# Altium project Cerberus_Board_v3.PrjPcb (part 2 of 3)

## Sheet spirit1_433.SchDoc: Spirit1_433
size A4; Author: r.rodriguezz; Organization: B105 Laboratory; Address1: Integrated Systems Laboratory; Address2: ETSIT - UPM; Address3: Avda Complutense, 30; Address4: 28040 Madrid Spain
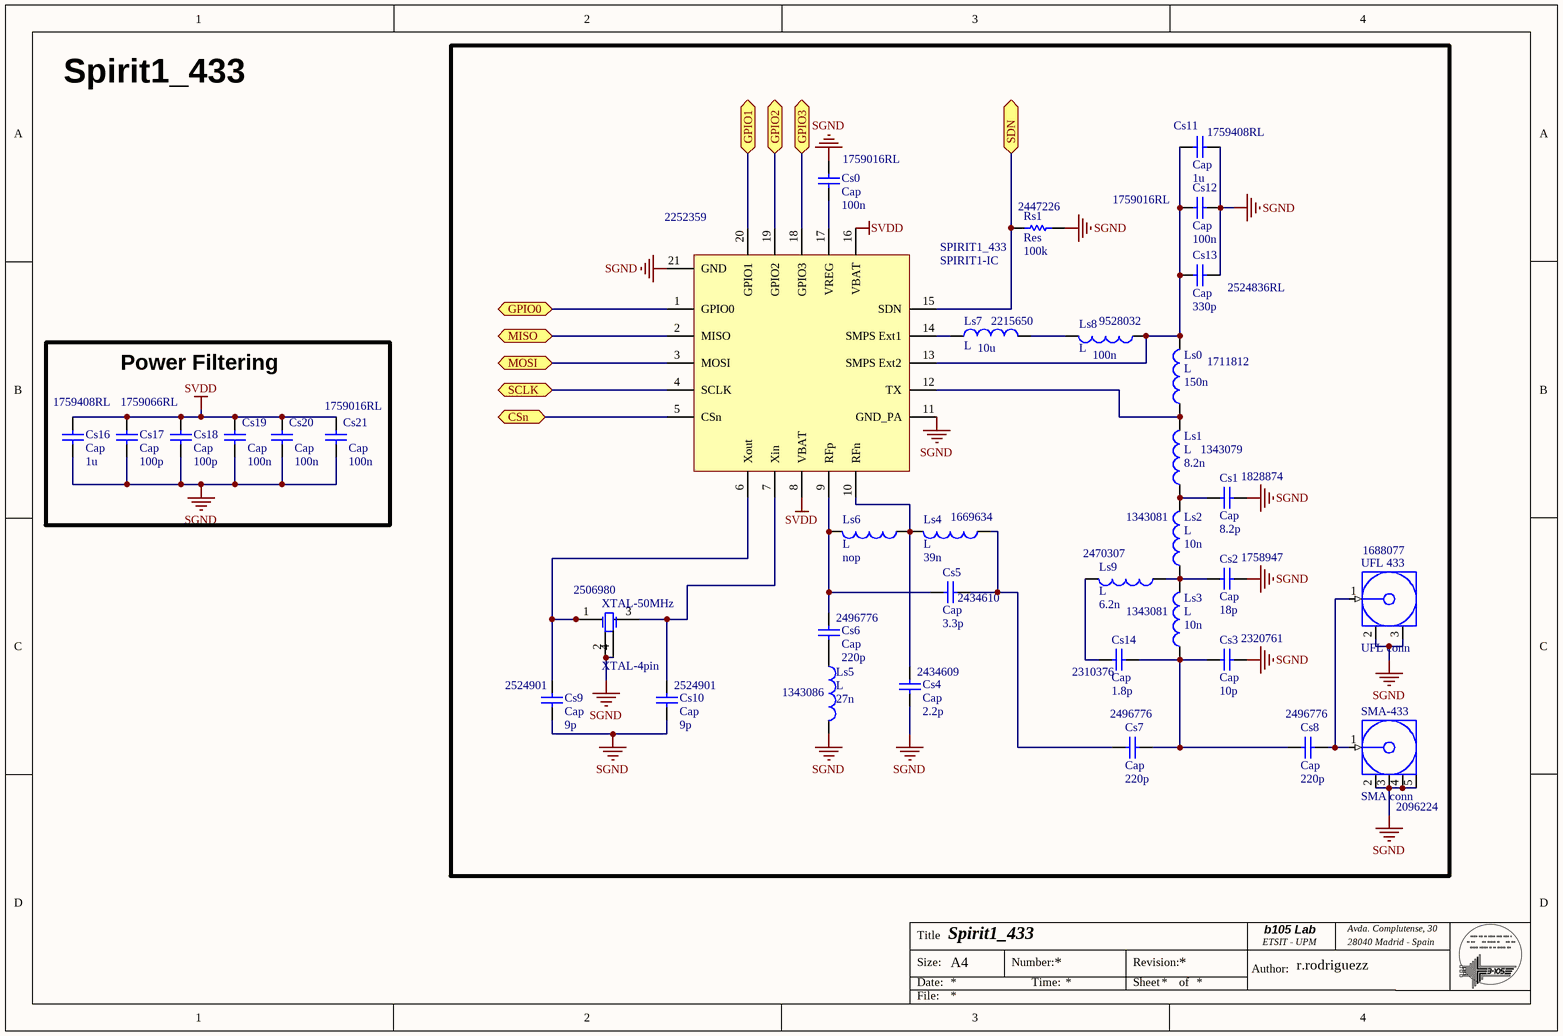
[diagram p2: spirit1_433.SchDoc]

### Parts
Cs0  Cap  value 100n  Supplier Part Number 1: 1759016RL  [0603 Cap]
Cs1  Cap  value 8.2p  Supplier Part Number 1: 1828874  [0402 CAP]
Cs2  Cap  value 18p  Supplier Part Number 1: 1758947  [0402 CAP]
Cs3  Cap  value 10p  Supplier Part Number 1: 2320761  [0402 CAP]
Cs4  Cap  value 2.2p  Supplier Part Number 1: 2434609  [0402 CAP]
Cs5  Cap  value 3.3p  Supplier Part Number 1: 2434610  [0402 CAP]
Cs6  Cap  value 220p  Supplier Part Number 1: 2496776  [0402 CAP]
Cs7  Cap  value 220p  Supplier Part Number 1: 2496776  [0402 CAP]
Cs8  Cap  value 220p  Supplier Part Number 1: 2496776  [0402 CAP]
Cs9  Cap  value 9p  Supplier Part Number 1: 2524901  [0603 Cap]
Cs10  Cap  value 9p  Supplier Part Number 1: 2524901  [0603 Cap]
Cs11  Cap  value 1u  Supplier Part Number 1: 1759408RL  [0603 Cap]
Cs12  Cap  value 100n  Supplier Part Number 1: 1759016RL  [0603 Cap]
Cs13  Cap  value 330p  Supplier Part Number 1: 2524836RL  [0603 Cap]
Cs14  Cap  value 1.8p  Supplier Part Number 1: 2310376  [0402 CAP]
Cs16  Cap  value 1u  Supplier Part Number 1: 1759408RL  [0603 Cap]
Cs17  Cap  value 100p  Supplier Part Number 1: 1759066RL  [0603 Cap]
Cs18  Cap  value 100p  [0603 Cap]
Cs19  Cap  value 100n  [0603 Cap]
Cs20  Cap  value 100n  [0603 Cap]
Cs21  Cap  value 100n  Supplier Part Number 1: 1759016RL  [0603 Cap]
Ls0  L  value 150n  Supplier Part Number 1: 1711812  [0603 IND]
Ls1  L  value 8.2n  Supplier Part Number 1: 1343079  [0402 IND]
Ls2  L  value 10n  Supplier Part Number 1: 1343081  [0402 IND]
Ls3  L  value 10n  Supplier Part Number 1: 1343081  [0402 IND]
Ls4  L  value 39n  Supplier Part Number 1: 1669634  [0402 IND]
Ls5  L  value 27n  Supplier Part Number 1: 1343086  [0402 IND]
Ls6  L  value nop  [0402 IND]
Ls7  L  value 10u  Supplier Part Number 1: 2215650  [0805 Ind]
Ls8  L  value 100n  Supplier Part Number 1: 9528032  [0603 IND]
Ls9  L  value 6.2n  Supplier Part Number 1: 2470307  [0402 IND]
Rs1  Res  value 100k  Supplier Part Number 1: 2447226  [0603 Res]
SMA-433  SMA conn  Supplier Part Number 1: 2096224  [SMA-conn]
SPIRIT1_433  SPIRIT1-IC  Supplier Part Number 1: 2252359  [QFN-20]
UFL_433  UFL conn  Supplier Part Number 1: 1688077  [UFL conn]
XTAL-50MHz  XTAL-4pin  Supplier Part Number 1: 2506980  [XTAL-4PIN-2mmx1.6mm]

### Blocks framed on the sheet
Power Filtering: Cs16-Cs21

### Ports
CSn (bidir), GPIO0 (bidir), GPIO1 (bidir), GPIO2 (bidir), GPIO3 (bidir), MISO (bidir), MOSI (bidir), SCLK (bidir), SDN (bidir)

### Nets
SGND: Cs0.2 Cs1.1 Cs2.1 Cs3.1 Cs4.1 Cs9.1 Cs10.1 Cs11.1 Cs12.1 Cs13.1 Cs16.1 Cs17.1 Cs18.1 Cs19.1 Cs20.1 Cs21.1 Ls5.2 Rs1.2 SMA-433.2(GND) SMA-433.3(GND) SMA-433.4(GND) SMA-433.5(GND) SPIRIT1_433.11(GND_PA) SPIRIT1_433.21(GND) UFL_433.2(GND) UFL_433.3(GND) XTAL-50MHz.2(GND) XTAL-50MHz.4(GND)
SVDD: Cs16.2 Cs17.2 Cs18.2 Cs19.2 Cs20.2 Cs21.2 SPIRIT1_433.8(VBAT) SPIRIT1_433.16(VBAT)
CS_S: SPIRIT1_433.5(CSn) ; port CSn
MISO: SPIRIT1_433.2(MISO) ; port MISO
MOSI: SPIRIT1_433.3(MOSI) ; port MOSI
S_GPIO3: SPIRIT1_433.18(GPIO3) ; port GPIO3
SCK: SPIRIT1_433.4(SCLK) ; port SCLK
SDN_S: Rs1.1 SPIRIT1_433.15(SDN) ; port SDN
NetCs0_1: Cs0.1 SPIRIT1_433.17(VREG)
NetCs1_2: Cs1.2 Ls1.1 Ls2.2
NetCs2_2: Cs2.2 Ls2.1 Ls3.2 Ls9.1
NetCs3_2: Cs3.2 Cs7.2 Cs8.1 Cs14.1 Ls3.1
NetCs4_2: Cs4.2 Ls4.2 Ls6.1 SPIRIT1_433.10(RFn)
NetCs5_1: Cs5.1 Cs7.1 Ls4.1
NetCs5_2: Cs5.2 Cs6.1 Ls6.2 SPIRIT1_433.9(RFp)
NetCs6_2: Cs6.2 Ls5.1
NetCs8_2: Cs8.2 SMA-433.1(Signal) UFL_433.1(Signal)
NetCs9_2: Cs9.2 SPIRIT1_433.6(Xout) XTAL-50MHz.1(OSC1)
NetCs10_2: Cs10.2 SPIRIT1_433.7(Xin) XTAL-50MHz.3(OSC2)
NetCs11_2: Cs11.2 Cs12.2 Cs13.2 Ls0.2 Ls8.1 SPIRIT1_433.13(SMPS_Ext2)
NetCs14_2: Cs14.2 Ls9.2
NetLs0_1: Ls0.1 Ls1.2 SPIRIT1_433.12(TX)
NetLs7_1: Ls7.1 SPIRIT1_433.14(SMPS_Ext1)
NetLs7_2: Ls7.2 Ls8.2
NetR10_2: SPIRIT1_433.1(GPIO0) ; port GPIO0
NetR11_2: SPIRIT1_433.20(GPIO1) ; port GPIO1
NetR12_2: SPIRIT1_433.19(GPIO2) ; port GPIO2

### Notes on the sheet
- Title
- Size:
- Date:
- A4
- Number:
- Time:
- Revision:
- Sheet
- of
- Author:
- ETSIT - UPM
- b105 Lab
- Avda. Complutense, 30
- 28040 Madrid - Spain
- File:

### Library data of the parts
Cs0 Cs12 Cs19-Cs21 = Cap: Manufacturer: MULTICOMP; Manufacturer Part Number: MC0603B104K160CT; Ceramic Capacitor Case: 0603 [1608 Metric]; Capacitance: 0.1; Voltage Rating: 16; Capacitance Tolerance: ± 10%; Dielectric Characteristic: X7; Product Range: MC Series; SVHC: No SVHC (17-Dec-2015)<!--FANDB--><div class="features-and-benefits-container"><div class="features-and-benefits-description"><span class="features-benefits-value">The Multicomp MC series is general purpose MLCC capacitors with X7R dielectric material which provides high electrical precision, stability and reliability. This MLCC capacitor consists of a conducting material and electrodes with high density and high efficiency ceramic condensers.</span></div><div class="features-and-benefits-list"><ul class="features-and-benefits-list-list"><li class="features-and-benefits-list-item">Small size with higher capacitance values</li><li class="features-and-benefits-list-item">0201, 0402, 0603, 0805, 1206, 1210, 1812 case sizes available</li><li class="features-and-benefits-list-item">Capacitance value ranging from 100pF to 47?F</li><li class="features-and-benefits-list-item">Capacitor with lead free termination (pure Tin)</li><li class="features-and-benefits-list-item">High electrical precision, stability and reliability</li><li class="features-and-benefits-list-item">Rated voltage of 6.3V, 10V, 16V, 25V, 50V, 100V</li><li class="features-and-benefits-list-item">Operating temperature of -55°C to +125°C</li><li class="features-and-benefits-list-item">Available in ±5%, ±10% and ±20; Description 1: MULTICOMP - MC0603B104K160CT - CAP, MLCC, X7R, 100NF, 16V, 0603; Supplier 1: Farnell; RoHS: YES; Stock 1: 78340; Pricing 1: 10=0.0065, 250=0.0053, 500=0.0044, 1000=0.0038, 2000=0.0033 (GBP); Packaging: Cut Tape; Operating Temperature Min: -55; Operating Temperature Max: 125; Automotive Qualification Standard: -; MSL: -; ComponentLink1URL: http://www.farnell.com/datasheets/1901289.pdf; ComponentLink1Description: http://www.farnell.com/datasheets/1901289.pdf
  Cs19 Cs20: Supplier Part Number 1: 1759016RL
Cs1 = Cap: Manufacturer: MURATA; Manufacturer Part Number: GRM1555C1H8R2CA01D; Description 1: MURATA - GRM1555C1H8R2CA01D - CAP, MLCC, C0G/NP0, 8.2PF, 50V, 0402; Ceramic Capacitor Case: 0402 [1005 Metric]; Capacitance: 8.2; Voltage Rating: 50; Capacitance Tolerance: ± 0.25; Dielectric Characteristic: C0G / NP0; Product Range: GRM Series; SVHC: No SVHC (17-Dec-2015); Capacitor Terminals: SMD<!--FANDB--><div class="features-and-benefits-container"><div class="features-and-benefits-description"><span class="features-benefits-value">The Murata GRM series capacitors are Multilayer Ceramic Chip Capacitors (MLCC) used for general purpose applications. These MLCC capacitors are classified into temperature compensating and high dielectric constant types depending on the change in electrostatic capacitance due to change in temperature. The temperature compensating capacitors feature a small rate of change in electrostatic capacitance as the temperature changes and are used for applications such as filters and high frequency circuit matching. The high dielectric constant capacitors use materials with a high dielectric constant and feature a large electrostatic capacitance. Typical applications are power supply decoupling and smoothing circuits.</span></div><div class="features-and-benefits-list"><ul class="features-and-benefits-list-list"><li class="features-and-benefits-list-item">Large capacity and small size in a multilayer structure</li><li class="features-and-benefits-list-item">Capacitance value ranging from 0.1pF to 220?F</li><li class="features-and-benefits-list-item">Tin plated external electrodes, excellent solderability</li><li class="features-and-benefits-list-item">Provides good high frequency characteristics</li><li class="features-and-benefits-list-item">Excellent pulse response</li><li class="features-and-benefits-list-item">High reliability</li><li class="features-and-benefits-list-item">Capacitor size varies from 0.4×0.2mm to 5.7×5.0mm</li><li class="features-and-benefits-list-item">Rated voltage of 2.5VDC to 3.15; Supplier 1: Farnell; RoHS: YES; Stock 1: 47518; Pricing 1: 10=0.0088, 100=0.008, 500=0.0055, 2500=0.0044, 5000=0.004, 10000=0.0037, 50000=0.0031, 100000=0.003 (GBP); ComponentLink1URL: http://www.farnell.com/datasheets/2048698.pdf; ComponentLink1Description: http://www.farnell.com/datasheets/2048698.pdf; Packaging: Cut Tape; Operating Temperature Min: -55; Operating Temperature Max: 125; Automotive Qualification Standard: -; MSL: -; Capacitance Tolerance ±: ± 0.25
Cs2 = Cap: Manufacturer: MULTICOMP; Manufacturer Part Number: MC0402N180J500CT; Description 1: MULTICOMP - MC0402N180J500CT - CAP, MLCC, C0G/NP0, 18PF, 50V, 0402; Ceramic Capacitor Case: 0402 [1005 Metric]; Capacitance: 18; Voltage Rating: 50; Capacitance Tolerance: ± 5%; Dielectric Characteristic: C0G / NP0; Product Range: MC Series; SVHC: No SVHC (17-Dec-2015); Capacitor Terminals: SMD; External Depth: 1; External Length / Height: 0.5; No. of Pins: 2; Temperature Coefficient: 0ppm/°C ± 30ppm/°C<!--FANDB--><div class="features-and-benefits-container"><div class="features-and-benefits-description"><span class="features-benefits-value">The Multicomp MC series is general purpose MLCC capacitors with C0G (NP0) dielectric material which provides high electrical precision, stability and reliability. This MLCC capacitor consists of a conducting material and electrodes with high density and high efficiency ceramic condensers.</span></div><div class="features-and-benefits-list"><ul class="features-and-benefits-list-list"><li class="features-and-benefits-list-item">Small size with higher capacitance values</li><li class="features-and-benefits-list-item">0201, 0402, 0603, 0805, 1206, 1210, 1812 case sizes available</li><li class="features-and-benefits-list-item">Capacitance value ranging from 0.1pF to 0.1?F</li><li class="features-and-benefits-list-item">Capacitor with lead free termination (pure Tin)</li><li class="features-and-benefits-list-item">High electrical precision, stability and reliability</li><li class="features-and-benefits-list-item">Rated voltage of 10V, 16V, 25V, 50V, 100V</li><li class="features-and-benefits-list-item">Operating temperature of -55°C to +125°C</li><li class="features-and-benefits-list-item">Temperature coefficient (TCR) of ±30; Supplier 1: Farnell; RoHS: YES; Stock 1: 64210; Pricing 1: 10=0.0039, 500=0.0031, 1000=0.0026, 2500=0.0022, 5000=0.0019 (GBP); ComponentLink1URL: http://www.farnell.com/datasheets/1901289.pdf; ComponentLink1Description: http://www.farnell.com/datasheets/1901289.pdf; Packaging: Cut Tape; Operating Temperature Min: -55; Operating Temperature Max: 125; Automotive Qualification Standard: -; MSL: -; Capacitance Tolerance ±: ± 5%; External Width: 0.5; Operating Temperature Range: -55°C to +125
Cs3 = Cap: Manufacturer: MULTICOMP; Manufacturer Part Number: MC0402N100J500CT; Description 1: MULTICOMP - MC0402N100J500CT - CAP, MLCC, C0G/NP0, 10PF, 50V, 0402; Ceramic Capacitor Case: 0402 [1005 Metric]; Capacitance: 10; Voltage Rating: 50; Capacitance Tolerance: ± 5%; Dielectric Characteristic: C0G / NP0; Product Range: MC Series; SVHC: No SVHC (15-Jun-2015); Capacitor Terminals: SMD<!--FANDB--><div class="features-and-benefits-container"><div class="features-and-benefits-description"><span class="features-benefits-value">The MC0402N100J500CT is a general purpose Multilayer Ceramic Capacitor with Cu/Ni/Sn-plated termination, C0G/NP0 dielectric and 0402 case. The multilayer ceramic capacitor consists of a conducting material and electrodes. To manufacture a chip-type SMT and achieve miniaturisation, high density and high efficiency, ceramic condensers are used. High electrical precision, stability and reliability.</span></div><div class="features-and-benefits-list"><ul class="features-and-benefits-list-list"><li class="features-and-benefits-list-item">High capacitance</li></ul></div><div class="features-and-benefits-applications"><ul class="features-and-benefits-value"><li class="features-and-benefits-list-item">Power Management</li><li class="features-and-benefits-list-item">Communications & Networking</li><li class="features-and-benefits-list-item">Consumer Electronics</li></ul></div></div>; Supplier 1: Farnell; RoHS: YES; Stock 1: 51122; Pricing 1: 10=0.0032, 750=0.0026, 1250=0.0022, 2500=0.0019, 5000=0.0016 (GBP); ComponentLink1URL: http://www.farnell.com/datasheets/1870456.pdf; ComponentLink1Description: http://www.farnell.com/datasheets/1870456.pdf; Packaging: Cut Tape; Operating Temperature Min: -55; Operating Temperature Max: 125; Automotive Qualification Standard: -; MSL: MSL 1 - Unlimited; Capacitance Tolerance ±: ± 5%
Cs4 = Cap: Manufacturer: MURATA; Manufacturer Part Number: GRM1555C1H2R2CA01D; Ceramic Capacitor Case: 0402 [1005 Metric]; Capacitance: 2.2; Voltage Rating: 50; Capacitance Tolerance: ± 0.25; Dielectric Characteristic: C0G / NP0; Product Range: GRM Series; SVHC: No SVHC (17-Dec-2015)<!--FANDB--><div class="features-and-benefits-container"><div class="features-and-benefits-description"><span class="features-benefits-value">The GRM1555C1H2R2CA01D is a Multilayer Ceramic Capacitor for general purpose, C0G/NP0 dielectric and 0402 case. Since the external electrodes consist of a plated structure, the product is excellent in soldering heat resistance. The profile dimensions have been standardized with high precision, therefore high reliability can be acquired in the case of automatic mounting.</span></div><div class="features-and-benefits-list"><ul class="features-and-benefits-list-list"><li class="features-and-benefits-list-item">High reliability with no polarity</li><li class="features-and-benefits-list-item">Low impedance in high frequencies and excellent in pulse response and noise elimination</li></ul></div><div class="features-and-benefits-applications"><ul class="features-and-benefits-value"><li class="features-and-benefits-list-item">Industrial</li></ul></div></div>; Description 1: MURATA - GRM1555C1H2R2CA01D - CAP, MLCC, C0G, 2.2PF, 50V, 0402; Supplier 1: Farnell; RoHS: YES; Stock 1: 63046; Pricing 1: 10=0.0065, 100=0.0045, 500=0.0034, 2500=0.0027, 5000=0.0024, 10000=0.0022, 50000=0.0018, 100000=0.0017 (GBP); Packaging: Cut Tape; Operating Temperature Min: -55; Operating Temperature Max: 125; Automotive Qualification Standard: -; MSL: MSL 1 - Unlimited; ComponentLink1URL: http://www.farnell.com/datasheets/2047874.pdf; ComponentLink1Description: http://www.farnell.com/datasheets/2047874.pdf
Cs5 = Cap: Manufacturer: MURATA; Manufacturer Part Number: GRM1555C1H3R3CA01D; Description 1: MURATA - GRM1555C1H3R3CA01D - CAP, MLCC, C0G, 3.3PF, 50V, 0402; Ceramic Capacitor Case: 0402 [1005 Metric]; Capacitance: 3.3; Voltage Rating: 50; Capacitance Tolerance: ± 0.25; Dielectric Characteristic: C0G / NP0; Product Range: GRM Series; SVHC: No SVHC (17-Dec-2015; Supplier 1: Farnell; RoHS: YES; Stock 1: 33151; Pricing 1: 10=0.0056, 100=0.0044, 500=0.0034, 2500=0.0027, 5000=0.0024, 10000=0.0022, 50000=0.0018, 100000=0.0017 (GBP); ComponentLink1URL: http://www.farnell.com/datasheets/2048261.pdf; ComponentLink1Description: http://www.farnell.com/datasheets/2048261.pdf; Packaging: Cut Tape; Operating Temperature Min: -55; Operating Temperature Max: 125; Automotive Qualification Standard: -; MSL: MSL 1 - Unlimited
Cs6-Cs8 = Cap: Manufacturer: WALSIN; Manufacturer Part Number: 0402B221K500CT; Ceramic Capacitor Case: 0402 [1005 Metric]; Capacitance: 220; Voltage Rating: 50; Capacitance Tolerance: ± 10%; Dielectric Characteristic: X7; Description 1: WALSIN - 0402B221K500CT - CAPACITOR, MLCC, X7R, 220PF, 50V, 0402; Supplier 1: Farnell; RoHS: YES; Stock 1: 29178; Pricing 1: 10=0.007, 500=0.005, 1000=0.0039, 2500=0.0031, 5000=0.0026 (GBP); Product Range: -; Packaging: Cut Tape; Operating Temperature Min: -55; Operating Temperature Max: 125; Automotive Qualification Standard: -; MSL: MSL 1 - Unlimited<!--FANDB--><div class="features-and-benefits-container"><div class="features-and-benefits-description"><span class="features-benefits-value">The general purpose series capacitors from Walsin are X7R dielectric multilayer ceramic chip capacitors (MLCC) that provides high electrical precision, stability and reliability. These MLCC capacitors consist of a conducting material and electrodes. The high density and high efficiency ceramic condensers are used to manufacture chip type miniaturized MLCC capacitors.</span></div><div class="features-and-benefits-list"><ul class="features-and-benefits-list-list"><li class="features-and-benefits-list-item">Capacitance values ranges from 100pF to 47?F</li><li class="features-and-benefits-list-item">EIA 0201, 0402, 0603, 0805, 1206, 1210, 1812 case sizes available</li><li class="features-and-benefits-list-item">Available voltage ratings are 6.3V, 10V, 16V, 25V, 35V, 50V, 100V</li><li class="features-and-benefits-list-item">Operating temperature range from -55°C to 125°C</li><li class="features-and-benefits-list-item">Available in ±5%, ±10%, ±20; ComponentLink1URL: http://www.farnell.com/datasheets/1958513.pdf; ComponentLink1Description: http://www.farnell.com/datasheets/1958513.pdf
Cs9 Cs10 = Cap: Manufacturer: WALSIN; Manufacturer Part Number: 0603N9R0D500CT; Ceramic Capacitor Case: 0603 [1608 Metric]; Capacitance: 9; Voltage Rating: 50; Capacitance Tolerance: ± 0.5; Dielectric Characteristic: C0G / NP0; Description 1: WALSIN - 0603N9R0D500CT - CAP, MLCC, C0G/NP0, 9PF, 50V, 0603, REEL; Supplier 1: Farnell; RoHS: YES; Stock 1: 5049; Pricing 1: 10=0.0179, 200=0.0127, 400=0.0099, 1000=0.0079, 2000=0.0066 (GBP); Product Range: -; Packaging: Cut Tape; Operating Temperature Min: -55; Operating Temperature Max: 125; Automotive Qualification Standard: -; MSL: MSL 1 - Unlimited<!--FANDB--><div class="features-and-benefits-container"></div>; ComponentLink1URL: http://www.farnell.com/datasheets/2009679.pdf; ComponentLink1Description: http://www.farnell.com/datasheets/2009679.pdf
Cs11 Cs16 = Cap: Manufacturer: MULTICOMP; Manufacturer Part Number: MC0603F105Z160CT; Description 1: MULTICOMP - MC0603F105Z160CT - CAP, MLCC, Y5V, 1UF, 0603; Ceramic Capacitor Case: 0603 [1608 Metric]; Capacitance: 1; Voltage Rating: 16; Capacitance Tolerance: +80%, -20%; Dielectric Characteristic: Y5; Product Range: MC Series; SVHC: No SVHC (15-Jun-2015); Capacitor Terminals: SMD; Supplier 1: Farnell; RoHS: YES; Stock 1: 184058; Pricing 1: 10=0.0114, 200=0.0084, 400=0.0074, 1000=0.0066, 2000=0.0055 (GBP); ComponentLink1URL: http://www.farnell.com/datasheets/1901289.pdf; ComponentLink1Description: http://www.farnell.com/datasheets/1901289.pdf; Packaging: Cut Tape; Operating Temperature Min: -30; Operating Temperature Max: 85; Automotive Qualification Standard: -; MSL: -; Capacitance Tolerance ±: +80%, -20%; Operating Temperature Range: -30°C to +85°C<!--FANDB--><div class="features-and-benefits-container"><div class="features-and-benefits-description"><span class="features-benefits-value">The Multicomp MC series is general purpose MLCC capacitors with Y5V dielectric material which provides high electrical precision, stability and reliability. This MLCC capacitor consists of a conducting material and electrodes with high density and high efficiency ceramic condensers.</span></div><div class="features-and-benefits-list"><ul class="features-and-benefits-list-list"><li class="features-and-benefits-list-item">Small size with higher capacitance values</li><li class="features-and-benefits-list-item">0201, 0402, 0603, 0805, 1206, 1210, 1812 case sizes available</li><li class="features-and-benefits-list-item">Capacitance value ranging from 0.01?F to 100?F</li><li class="features-and-benefits-list-item">Capacitor with lead free termination (pure Tin)</li><li class="features-and-benefits-list-item">High electrical precision, stability and reliability</li><li class="features-and-benefits-list-item">Rated voltage of 6.3V, 10V, 16V, 25V, 50V, 100V</li><li class="features-and-benefits-list-item">Operating temperature of -25°C to +85°C</li><li class="features-and-benefits-list-item">Available in ±20% and -20/+80
Cs13 = Cap: Manufacturer: WALSIN; Manufacturer Part Number: 0603B331K500CT; Description 1: WALSIN - 0603B331K500CT - CAP, MLCC, X7R, 330PF, 50V, 0603, REEL; Ceramic Capacitor Case: 0603 [1608 Metric]; Capacitance: 330; Voltage Rating: 50; Capacitance Tolerance: ± 10%; Dielectric Characteristic: X7; Supplier 1: Farnell; RoHS: YES; Stock 1: 5430; Pricing 1: 10=0.0137, 200=0.0097, 400=0.0075, 1000=0.006, 2000=0.005 (GBP); ComponentLink1URL: http://www.farnell.com/datasheets/2009679.pdf; ComponentLink1Description: http://www.farnell.com/datasheets/2009679.pdf; Product Range: -; Packaging: Cut Tape; Operating Temperature Min: -55; Operating Temperature Max: 125; Automotive Qualification Standard: -; MSL: MSL 1 - Unlimited<!--FANDB--><div class="features-and-benefits-container"></div>
Cs14 = Cap: Manufacturer: MULTICOMP; Manufacturer Part Number: MCRF15N1R8A500CT; Capacitance: 1.8; Voltage Rating: 50; Product Range: MCRF Series; Capacitance Tolerance: ± 0.05; Capacitor Case Style: 0402 [1005 Metric]; Description 1: MULTICOMP - MCRF15N1R8A500CT - CAP, RF, NP0, 1.8PF, 50V, 0402; Supplier 1: Farnell; RoHS: YES; Stock 1: 35152; Pricing 1: 10=0.0345, 100=0.0292, 500=0.0253, 2500=0.0184, 5000=0.0175, 10000=0.0166, 50000=0.0141, 100000=0.0125 (GBP); Packaging: Cut Tape; Operating Temperature Max: 125; Automotive Qualification Standard: -; Capacitance Tolerance ±: ± 0.05; Operating Temperature Min: -55; ComponentLink1URL: http://www.farnell.com/datasheets/1825576.pdf; ComponentLink1Description: http://www.farnell.com/datasheets/1825576.pdf
Cs17 Cs18 = Cap: Manufacturer: MULTICOMP; Manufacturer Part Number: MC0603N101J500CT; Ceramic Capacitor Case: 0603 [1608 Metric]; Capacitance: 100; Voltage Rating: 50; Capacitance Tolerance: ± 5%; Dielectric Characteristic: C0G / NP0; Product Range: MC Series; SVHC: No SVHC (17-Dec-2015); Capacitor Terminals: SMD; External Depth: 1.6; External Length / Height: 0.8; No. of Pins: 2; Temperature Coefficient: 0ppm/°C ± 30ppm/°C<!--FANDB--><div class="features-and-benefits-container"><div class="features-and-benefits-description"><span class="features-benefits-value">The Multicomp MC series is general purpose MLCC capacitors with C0G (NP0) dielectric material which provides high electrical precision, stability and reliability. This MLCC capacitor consists of a conducting material and electrodes with high density and high efficiency ceramic condensers.</span></div><div class="features-and-benefits-list"><ul class="features-and-benefits-list-list"><li class="features-and-benefits-list-item">Small size with higher capacitance values</li><li class="features-and-benefits-list-item">0201, 0402, 0603, 0805, 1206, 1210, 1812 case sizes available</li><li class="features-and-benefits-list-item">Capacitance value ranging from 0.1pF to 0.1?F</li><li class="features-and-benefits-list-item">Capacitor with lead free termination (pure Tin)</li><li class="features-and-benefits-list-item">High electrical precision, stability and reliability</li><li class="features-and-benefits-list-item">Rated voltage of 10V, 16V, 25V, 50V, 100V</li><li class="features-and-benefits-list-item">Operating temperature of -55°C to +125°C</li><li class="features-and-benefits-list-item">Temperature coefficient (TCR) of ±30; Supplier 1: Farnell; RoHS: YES; Stock 1: 24495; Pricing 1: 10=0.0058, 300=0.0047, 500=0.004, 1000=0.0034, 2000=0.0029 (GBP); Packaging: Cut Tape; Operating Temperature Min: -55; Operating Temperature Max: 125; Automotive Qualification Standard: -; MSL: -; Capacitance Tolerance ±: ± 5%; External Width: 0.8; Operating Temperature Range: -55°C to +125; ComponentLink1URL: http://www.farnell.com/datasheets/1901289.pdf; ComponentLink1Description: http://www.farnell.com/datasheets/1901289.pdf
  Cs18: Supplier Part Number 1: 1759066RL
Ls0 = Ind: Manufacturer: MULTICOMP; Manufacturer Part Number: MCFT000097; Product Range: MCFT Series; Inductance: 150; DC Current Rating: 280; High Frequency Inductor Case: 0603 [1608 Metric]; Inductor Construction: Wirewound; DC Resistance Max: 0.95; Inductance Tolerance: ± 5%; Self Resonant Frequency Min: 1.3; SVHC: No SVHC (15-Jun-2015); External Depth: 1.12; External Length / Height: 1.02; External Width: 1.8; Inductor Case Style: 0603 [1608 Metric]<!--FANDB--><div class="features-and-benefits-container"></div>; Description 1: MULTICOMP - MCFT000097 - INDUCTOR, 0603, 150NH; Supplier 1: Farnell; RoHS: YES; Stock 1: 603; Pricing 1: 10=0.149, 100=0.089, 500=0.0618, 1000=0.0514, 2000=0.045, 4000=0.0401, 20000=0.0338, 40000=0.0292 (GBP); Packaging: Cut Tape; ComponentLink1URL: http://www.farnell.com/datasheets/1636792.pdf; ComponentLink1Description: http://www.farnell.com/datasheets/1636792.pdf
Ls1 = Ind: Manufacturer: MURATA; Manufacturer Part Number: LQG15HN8N2J02D; Product Range: LQG15; Inductance: 8.2; DC Current Rating: 300; High Frequency Inductor Case: 0402 [1005 Metric]; Inductor Construction: Multilayer; DC Resistance Max: 0.33; Inductance Tolerance: ± 5%; Self Resonant Frequency Min: 3.6; SVHC: No SVHC (17-Dec-2015; Description 1: MURATA - LQG15HN8N2J02D - INDUCTOR, 0402 CASE, 8.2NH±5%; Supplier 1: Farnell; RoHS: YES; Stock 1: 10880; Pricing 1: 10=0.0446, 100=0.0349, 500=0.0253, 2500=0.0181, 5000=0.0174, 10000=0.0166, 50000=0.0141, 100000=0.0129 (GBP); Packaging: Cut Tape; ComponentLink1URL: http://www.farnell.com/datasheets/66026.pdf; ComponentLink1Description: http://www.farnell.com/datasheets/66026.pdf
Ls2 Ls3 = Ind: Manufacturer: MURATA; Manufacturer Part Number: LQG15HN10NJ02D; Product Range: LQG15; Inductance: 10; DC Current Rating: 300; High Frequency Inductor Case: 0402 [1005 Metric]; Inductor Construction: Multilayer; DC Resistance Max: 0.35; Inductance Tolerance: ± 5%; Self Resonant Frequency Min: 3.2; SVHC: No SVHC (17-Dec-2015; Description 1: MURATA - LQG15HN10NJ02D - INDUCTOR, 0402 CASE, 10NH±5%; Supplier 1: Farnell; RoHS: YES; Stock 1: 13359; Pricing 1: 10=0.0436, 100=0.0315, 500=0.0253, 2500=0.0181, 5000=0.0174, 10000=0.0166, 50000=0.0141, 100000=0.0129 (GBP); Packaging: Cut Tape; ComponentLink1URL: http://www.farnell.com/datasheets/66026.pdf; ComponentLink1Description: http://www.farnell.com/datasheets/66026.pdf
Ls4 = Ind: Manufacturer: TDK; Manufacturer Part Number: MLK1005S39NJ; Description 1: TDK - MLK1005S39NJ - INDUCTOR, HI FREQUENCY, 39NH, 0402; Product Range: MLK Series; Inductance: 39; DC Current Rating: 200; High Frequency Inductor Case: 0402 [1005 Metric]; Inductor Construction: Multilayer; DC Resistance Max: 1; Inductance Tolerance: ± 5%; Self Resonant Frequency Min: 2; SVHC: No SVHC (15-Jun-2015); Inductor Case Style: 0402 [1005 Metric]<!--FANDB--><div class="features-and-benefits-container"></div>; Supplier 1: Farnell; RoHS: YES; Stock 1: 3516; Pricing 1: 10=0.0381, 100=0.0323, 500=0.0214, 2500=0.0167, 5000=0.0151, 10000=0.0138, 50000=0.0118, 100000=0.0114 (GBP); ComponentLink1URL: http://www.farnell.com/datasheets/321063.pdf; ComponentLink1Description: http://www.farnell.com/datasheets/321063.pdf; Packaging: Cut Tape
Ls5 = Ind: Manufacturer: MURATA; Manufacturer Part Number: LQG15HN27NJ02D; Product Range: LQG15; Inductance: 27; DC Current Rating: 300; High Frequency Inductor Case: 0402 [1005 Metric]; Inductor Construction: Multilayer; DC Resistance Max: 0.67; Inductance Tolerance: ± 5%; Self Resonant Frequency Min: 1.6; SVHC: No SVHC (17-Dec-2015; Description 1: MURATA - LQG15HN27NJ02D - INDUCTOR, 0402 CASE, 27NH±5%; Supplier 1: Farnell; RoHS: YES; Stock 1: 8391; Pricing 1: 10=0.0439, 100=0.033, 500=0.0247, 2500=0.0177, 5000=0.017, 10000=0.0162, 50000=0.0138, 100000=0.0127 (GBP); Packaging: Cut Tape; ComponentLink1URL: http://www.farnell.com/datasheets/66026.pdf; ComponentLink1Description: http://www.farnell.com/datasheets/66026.pdf
Ls6 = Ind
Ls7 = Ind: Manufacturer: TDK; Manufacturer Part Number: MLZ2012M100WT; Product Range: MLZ Series; Inductance: 10; DC Current Rating: 350; High Frequency Inductor Case: 0805 [2012 Metric]; Inductor Construction: Multilayer; DC Resistance Max: 0.47; Inductance Tolerance: ± 20%; Self Resonant Frequency Min: 30; SVHC: No SVHC (15-Jun-2015); Inductor Case Style: 0805 [2012 Metric]<!--FANDB--><div class="features-and-benefits-container"><div class="features-and-benefits-description"><span class="features-benefits-value">The MLZ2012M100WT is a SMD multilayer Inductor for decoupling power circuits. The inductor choke has increased its DC superimposition characteristics by up to 250; Description 1: TDK - MLZ2012M100WT - INDUCTOR, SHIELDED, 10UH, 20%; Supplier 1: Farnell; RoHS: YES; Stock 1: 54003; Pricing 1: 5=0.111, 50=0.0755, 250=0.058, 500=0.0518, 1000=0.0447, 2000=0.0401, 10000=0.0314, 20000=0.0308 (GBP); Packaging: Cut Tape; ComponentLink1URL: http://www.farnell.com/datasheets/1649095.pdf; ComponentLink1Description: http://www.farnell.com/datasheets/1649095.pdf; ComponentLink2URL: http://www.farnell.com/datasheets/1828949.pdf; ComponentLink2Description: http://www.farnell.com/datasheets/1828949.pdf
Ls8 = Ind: Manufacturer: MURATA; Manufacturer Part Number: LQW18ANR10G00D; Product Range: LQW18A_00 Series; Inductance: 100; DC Current Rating: 220; High Frequency Inductor Case: 0603 [1608 Metric]; Inductor Construction: Wirewound; DC Resistance Max: 0.68; Inductance Tolerance: ± 2%; Self Resonant Frequency Min: 1.8; SVHC: No SVHC (17-Dec-2015); External Depth: 0.8; External Length / Height: 1.6; Description 1: MURATA - LQW18ANR10G00D - INDUCTOR, 0603 CASE, 100NH; Supplier 1: Farnell; RoHS: YES; Stock 1: 4127; Pricing 1: 10=0.169, 100=0.12, 500=0.0972, 1000=0.0888, 2000=0.0757, 4000=0.0722, 20000=0.0687, 40000=0.0673 (GBP); Packaging: Cut Tape; External Width: 0.8; Inductor Case Style: 0603 [1608 Metric]; Operating Temperature Max: 105; Operating Temperature Min: -55; ComponentLink1URL: http://www.farnell.com/datasheets/1487239.pdf; ComponentLink1Description: http://www.farnell.com/datasheets/1487239.pdf
Ls9 = Ind: Manufacturer: MURATA; Manufacturer Part Number: LQW15AN6N2B00D; Description 1: MURATA - LQW15AN6N2B00D - INDUCTOR, 6.2NH, 0.7A, 0.1NH, 8GHZ; Product Range: LQW15; Inductance: 6.2; DC Current Rating: 700; High Frequency Inductor Case: 0402 [1005 Metric]; Inductor Construction: Unshielded; DC Resistance Max: 0.09; Inductance Tolerance: ± 0.1; Self Resonant Frequency Min: 8; SVHC: No SVHC (17-Dec-2015; Supplier 1: Farnell; RoHS: YES; Stock 1: 2298; Pricing 1: 10=0.194, 100=0.133, 500=0.0943, 2500=0.0741, 5000=0.0714, 10000=0.0686, 50000=0.0659, 100000=0.0646 (GBP); ComponentLink1URL: http://www.farnell.com/datasheets/1888711.pdf; ComponentLink1Description: http://www.farnell.com/datasheets/1888711.pdf; Packaging: Cut Tape
Rs1 = Res: Manufacturer: MULTICOMP; Manufacturer Part Number: MCWR06X1003FTL; Resistance: 100; Voltage Rating: 50; Resistor Case Style: 0603 [1608 Metric]; Resistance Tolerance: ± 1%; Product Range: MCWR Series; Resistor Element Material: Thick Film; Temperature Coefficient: ± 100; SVHC: No SVHC (17-Dec-2015)<!--FANDB--><div class="features-and-benefits-container"><div class="features-and-benefits-description"><span class="features-benefits-value">The MCWR06X1003FTL is a thick film Chip Resistor with 0603 chip format. The resistor is constructed in a high grade ceramic body (aluminium oxide). Internal metal electrodes are added at each end and connected by a resistive paste that is applied to the top surface of the substrate. The composition of the paste is adjusted to give the approximate resistance required and the value is trimmed to within tolerance by laser cutting of this resistive layer.</span></div><div class="features-and-benefits-list"><ul class="features-and-benefits-list-list"><li class="features-and-benefits-list-item">High reliability and stability</li><li class="features-and-benefits-list-item">Reduced size of final equipment</li><li class="features-and-benefits-list-item">Lower assembly costs</li><li class="features-and-benefits-list-item">Higher component and equipment reliability</li></ul></div><div class="features-and-benefits-applications"><ul class="features-and-benefits-value"><li class="features-and-benefits-list-item">Consumer Electronics</li><li class="features-and-benefits-list-item">Computers & Computer Peripherals</li><li class="features-and-benefits-list-item">Communications & Networking</li></ul></div></div>; Description 1: MULTICOMP - MCWR06X1003FTL - RES, THICK FILM, 100K, 1%, 0.1W, 0603; Supplier 1: Farnell; RoHS: YES; Stock 1: 64993; Pricing 1: 10=0.0027, 500=0.0016, 750=0.0012, 1250=0.0009, 2500=0.0007 (GBP); Power Rating: 100; Packaging: Cut Tape; Automotive Qualification Standard: -; ComponentLink1URL: http://www.farnell.com/datasheets/1849611.pdf; ComponentLink1Description: http://www.farnell.com/datasheets/1849611.pdf
SMA-433 = SMA conn: Manufacturer: LPRS; Manufacturer Part Number: SMA RA CONNECTOR; Description 1: LPRS - SMA RA CONNECTOR - CONNECTOR, SMA, R/ANGLED; Connector Type: SMA Coaxial; Coaxial Termination: Solder; Connector Mounting: PCB Mount; SVHC: No SVHC (15-Jun-2015)<!--FANDB--><div class="features-and-benefits-container"><div class="features-and-benefits-description"><span class="features-benefits-value">The SMA RA CONNECTOR is a SMA right angle Coaxial Connector, used for antennas.</span></div><div class="features-and-benefits-list"><ul class="features-and-benefits-list-list"><li class="features-and-benefits-list-item">50; Supplier 1: Farnell; RoHS: YES; Stock 1: 3978; Pricing 1: 1=1.01 (GBP); Connector Body Style: -; Impedance: -; Coaxial Cable Types: -; Contact Material: -; Contact Plating: -; Frequency Max: -; Product Range: -; ComponentLink1URL: http://www.farnell.com/datasheets/1558212.pdf; ComponentLink1Description: http://www.farnell.com/datasheets/1558212.pdf
SPIRIT1_433 = SPIRIT1-IC: Manufacturer: STMICROELECTRONICS; Manufacturer Part Number: SPIRIT1QTR; Frequency Min: 150; Frequency Max: 956; RF / IF Modulation: 2; Data Rate: 500; Receiving Current: 9; RF IC Case Style: QFN; No. of Pins: 20; Supply Voltage Min: 1.8; Supply Voltage Max: 3.6; Transmitting Current: 21; Output Power (dBm): 11; Sensitivity dBm: -118; RF Transceiver Applications: AMR, Home Automation, Low Power Telemetry, Wireless Alarm & Security System; SVHC: No SVHC (17-Dec-2015); Frequency Range: 150MHz to 956; Supply Voltage Range: 1.8V to 3.6V<!--FANDB--><div class="features-and-benefits-container"><div class="features-and-benefits-description"><span class="features-benefits-value">The SPIRIT1QTR is a very low-power RF Transceiver IC. It is designed to operate both in the license-free ISM and SRD frequency bands at 169, 315, 433, 868 and 915MHz, but can also be programmed to operate at other additional frequencies in the 300 to 348MHz, 387 to 470MHz and 779 to 956MHz bands. The air data rate is programmable from 1 to 500kbps and the SPIRIT1 can be used in systems with channel spacing of 12.5/25kHz, complying with the EN 300 220 standard. It uses a very small number of discrete external components and integrates a configurable baseband modem, which supports data management, modulation and demodulation. The data management handles the data in the proprietary fully programmable packet format also allows the M-Bus standard compliance format (all performance classes). However, the SPIRIT1QTR can perform cyclic redundancy checks on the data as well as FEC encoding/decoding on the packets.</span></div><div class="features-and-benefits-list"><ul class="features-and-benefits-list-list"><li class="features-and-benefits-list-item">Very Low Power Consumption (9mA RX and 21mA TX at +11dBm)</li><li class="features-and-benefits-list-item">Programmable RX Digital Filter from 1 to 800kHz</li><li class="features-and-benefits-list-item">Programmable Channel Spacing (12.5kHz Minimum)</li><li class="features-and-benefits-list-item">Programmable Output Power up to +16dBm</li><li class="features-and-benefits-list-item">Fast Startup and Frequency Synthesizer Settling Time (6?s)</li><li class="features-and-benefits-list-item">Frequency Offset Compensation</li><li class="features-and-benefits-list-item">Integrated Temperature Sensor</li><li class="features-and-benefits-list-item">Battery Indicator and Low Battery Detector</li><li class="features-and-benefits-list-item">RX and TX FIFO Buffer (96 Bytes Each)</li><li class="features-and-benefits-list-item">Configurability via SPI Interface</li><li class="features-and-benefits-list-item">Automatic Acknowledgment, Retransmission and Timeout Protocol Engine</li><li class="features-and-benefits-list-item">AES 128; Description 1: STMICROELECTRONICS - SPIRIT1QTR - IC, RF TRX, LOW POWER SUB1GHZ, QFN20; Supplier 1: Farnell; RoHS: YES; Stock 1: 1845; Pricing 1: 1=1.99, 10=1.95, 100=1.92, 250=1.87, 500=1.84, 1000=1.8, 2000=1.77, 3000=1.72 (GBP); Operating Temperature Min: -40; Operating Temperature Max: 85; Packaging: Each; Product Range: -; MSL: MSL 1 - Unlimited; Modulation Type: 2; Operating Temperature Range: -40°C to +85; ComponentLink1URL: http://www.farnell.com/datasheets/2019499.pdf; ComponentLink1Description: http://www.farnell.com/datasheets/2019499.pdf; ComponentLink2URL: http://www.farnell.com/cad/1724439.zip; ComponentLink2Description: http://www.farnell.com/cad/1724439.zip
UFL_433 = UFL conn: Manufacturer: HIROSE(HRS); Manufacturer Part Number: U.FL-R-SMT-1(10); Description 1: HIROSE(HRS) - U.FL-R-SMT-1(10) - RF COAXIAL, U.FL, STRAIGHT JACK, 50OHM; Supplier 1: Farnell; RoHS: YES; Stock 1: 49334; Pricing 1: 1=0.502, 10=0.499, 25=0.495, 50=0.493, 100=0.477 (GBP); ComponentLink1URL: http://www.farnell.com/cad/2110742.pdf; ComponentLink1Description: http://www.farnell.com/cad/2110742.pdf; ComponentLink2URL: http://bcove.me/8op6hfnt; ComponentLink2Description: http://bcove.me/8op6hfnt; ComponentLink3URL: http://www.farnell.com/datasheets/1947917.pdf; ComponentLink3Description: http://www.farnell.com/datasheets/1947917.pdf; ComponentLink4URL: http://www.farnell.com/cad/2115175.stp; ComponentLink4Description: http://www.farnell.com/cad/2115175.stp
XTAL-50MHz = XTAL-4pin: Manufacturer: EPSON; Manufacturer Part Number: X1E000351002812; Frequency Nom: 50; Crystal Case: SMD, 2mm x 1.6; Frequency Stability + / -: 10; Load Capacitance: 7; Product Range: FA2016; Description 1: EPSON - X1E000351002812 - CRYSTAL, 50MHZ, 7PF, 2MM X 1.6MM; Supplier 1: Farnell; RoHS: YES; Stock 1: 429; Pricing 1: 1=1.44, 10=1.09, 25=0.98, 50=0.89, 100=0.81, 250=0.74, 1250=0.725, 2500=0.71 (GBP); Frequency Tolerance + / -: 10; Operating Temperature Min: -20; Operating Temperature Max: 75; MSL: MSL 1 - Unlimited<!--FANDB--><div class="features-and-benefits-container"></div>; ComponentLink1URL: http://www.farnell.com/datasheets/1995806.pdf; ComponentLink1Description: http://www.farnell.com/datasheets/1995806.pdf